# EAGLE design PCB (EAGLE 7.4.0)

## Sheet 1 of 2
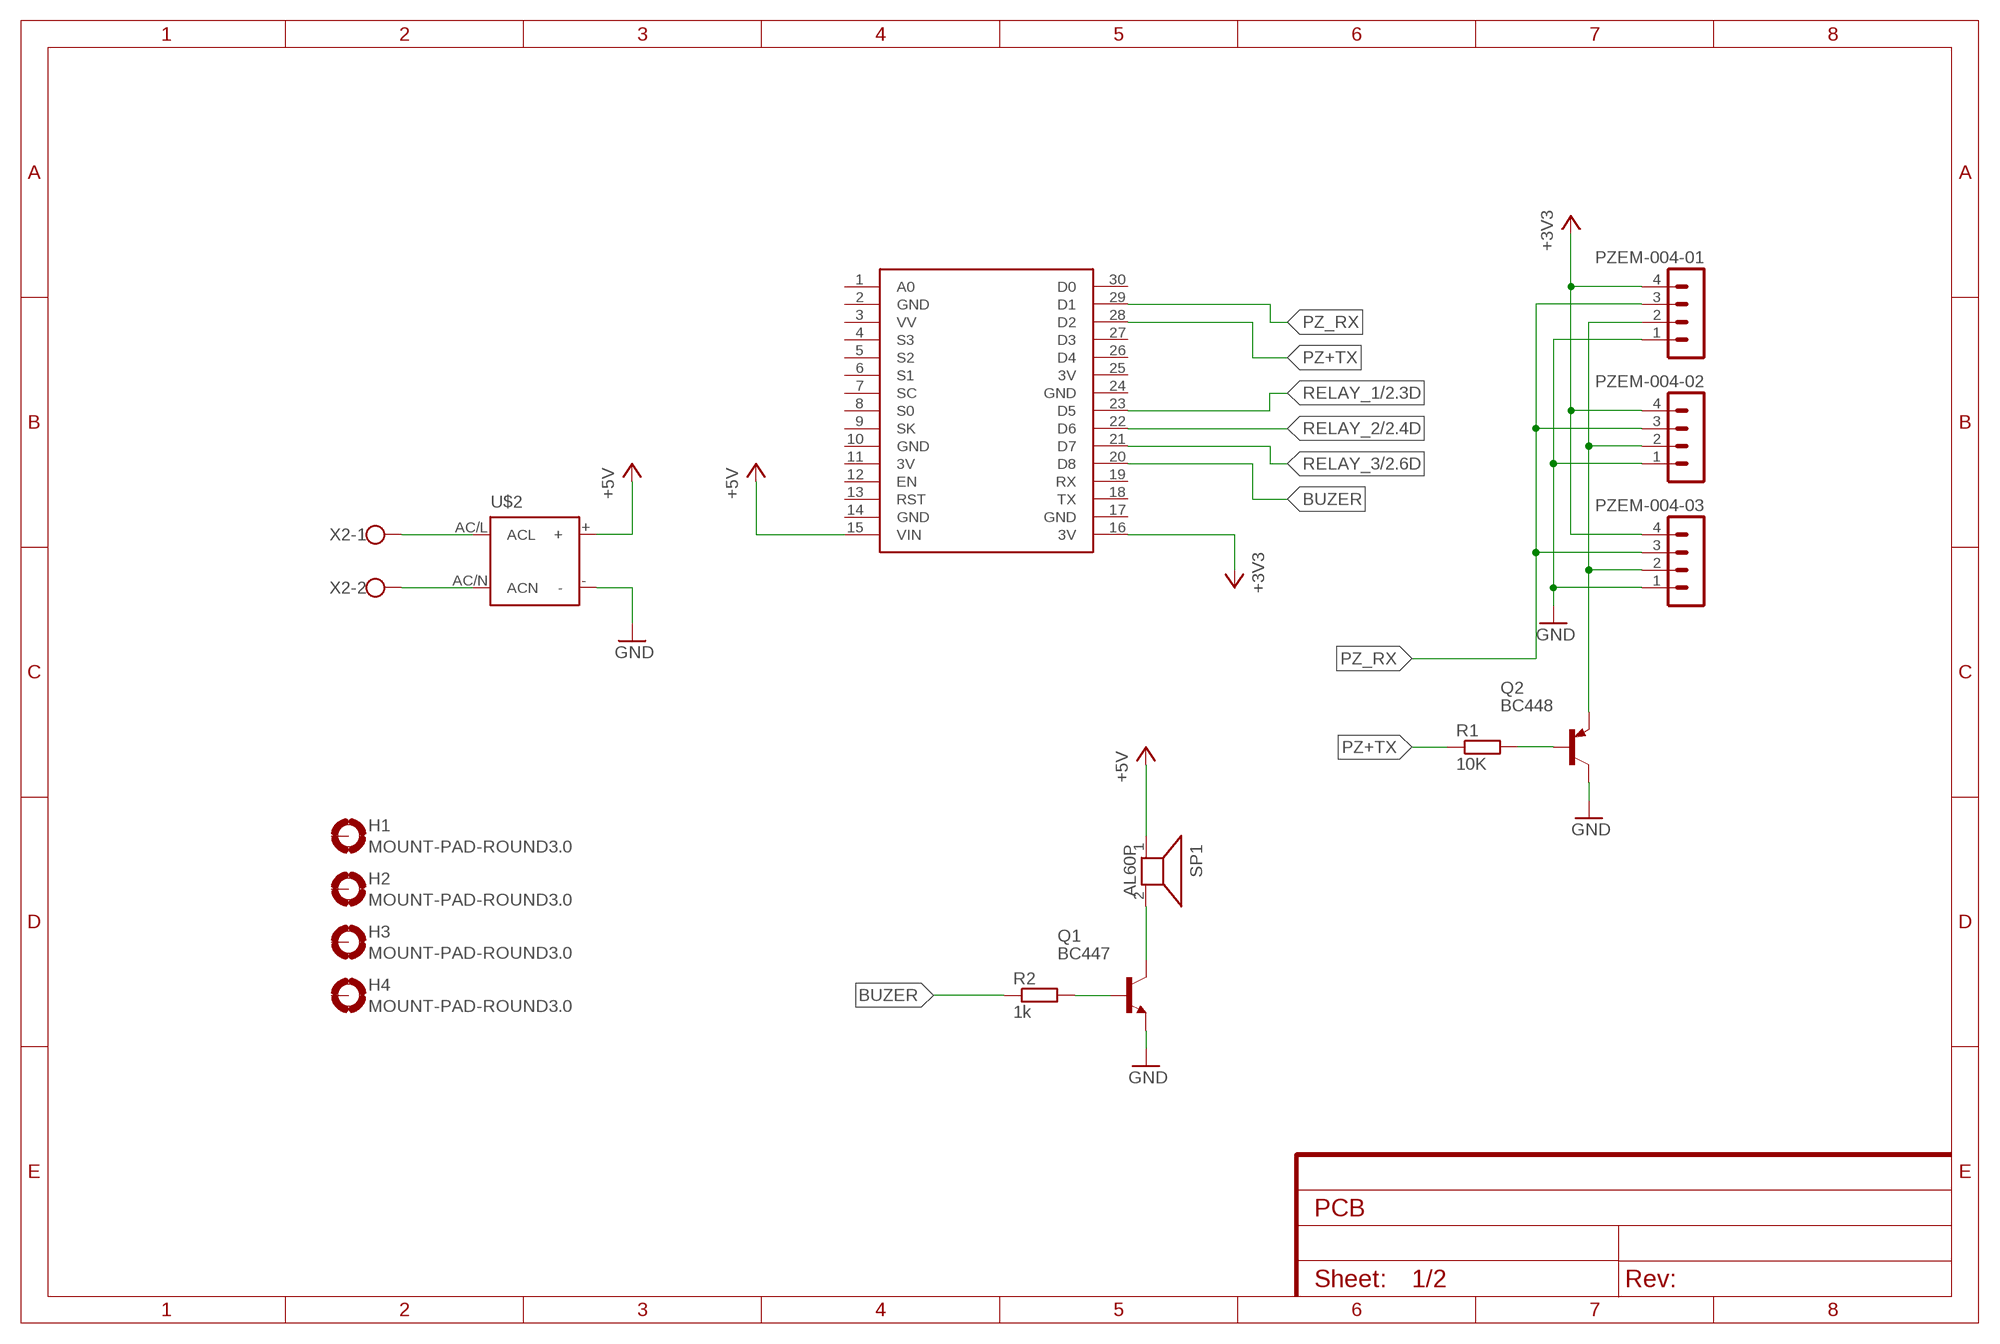
[diagram p0: schematic, sheet 1]

### Parts
H1  MOUNT-PAD-ROUND3.0  [3,0-PAD]
H2  MOUNT-PAD-ROUND3.0  [3,0-PAD]
H3  MOUNT-PAD-ROUND3.0  [3,0-PAD]
H4  MOUNT-PAD-ROUND3.0  [3,0-PAD]
PZEM-004-01  MA04-1  [MA04-1]
PZEM-004-02  MA04-1  [MA04-1]
PZEM-004-03  MA04-1  [MA04-1]
Q1  BC447  [TO92-EBC]
Q2  BC448  [TO92-EBC]
R1  10K  R-EU_0207/10  [0207/10]
R2  1k  R-EU_0207/10  [0207/10]
SP1  AL60P  [AL60P]
U$1  NODEMCU  [NODEMCU]
U$2  PM-05  [PM-05]
X2  W237-102  [W237-102]

### Nets
+3V3: PZEM-004-01.4 PZEM-004-02.4 PZEM-004-03.4 U$1.16(3V)
+5V: SP1.1 U$1.15(VIN) U$2.+ ; also sheet 2
BUZER: R2.1 U$1.20(D8)
GND: PZEM-004-01.1 PZEM-004-02.1 PZEM-004-03.1 Q1.E Q2.C U$2.- ; also sheet 2
N$1: Q1.C SP1.2
N$2: Q1.B R2.2
N$3: Q2.B R1.2
N$4: PZEM-004-01.2 PZEM-004-02.2 PZEM-004-03.2 Q2.E
N$21: U$2.AC/N(ACN) X2.2
N$22: U$2.AC/L(ACL) X2.1
PZ+TX: R1.1 U$1.28(D2)
PZ_RX: PZEM-004-01.3 PZEM-004-02.3 PZEM-004-03.3 U$1.29(D1)
RELAY_1: U$1.23(D5) ; also sheet 2
RELAY_2: U$1.22(D6) ; also sheet 2
RELAY_3: U$1.21(D7) ; also sheet 2
Unconnected: H1.B3,0(MOUNT) H2.B3,0(MOUNT) H3.B3,0(MOUNT) H4.B3,0(MOUNT) U$1.1(A0) U$1.3(VV) U$1.4(S3) U$1.5(S2) U$1.6(S1) U$1.7(SC) U$1.8(S0) U$1.9(SK) U$1.12(EN) U$1.13(RST) U$1.18(TX) U$1.19(RX) U$1.26(D4) U$1.27(D3) U$1.30(D0)

## Sheet 2 of 2
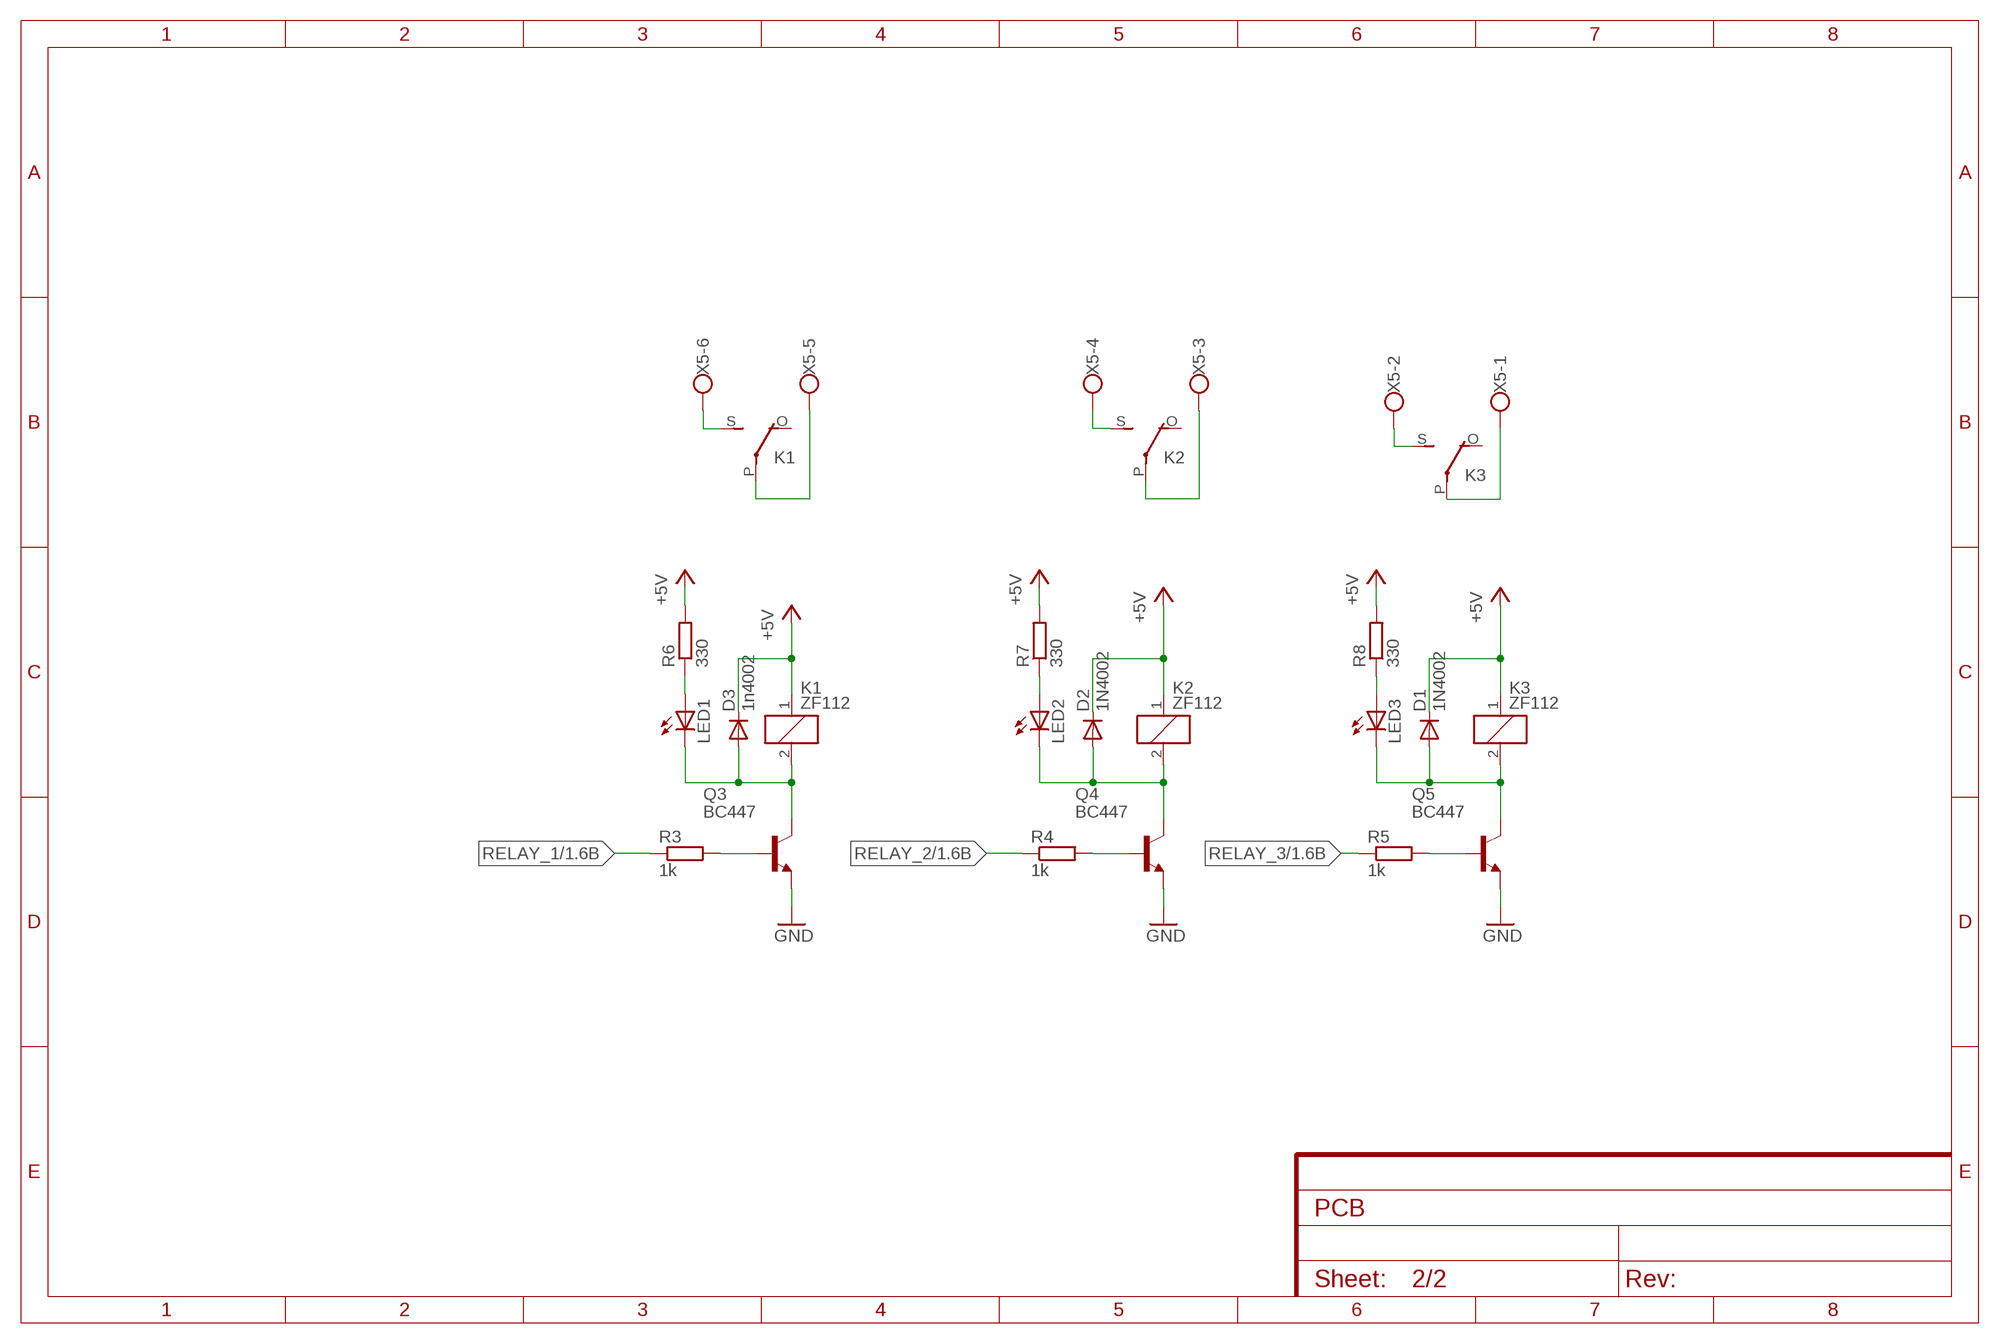
[diagram p1: schematic, sheet 2]

### Parts
D1  1N4002  1N4446  [DO35-10]
D2  1N4002  1N4446  [DO35-10]
D3  1n4002  1N4446  [DO35-10]
K1  ZF112  [ZF112]
K2  ZF112  [ZF112]
K3  ZF112  [ZF112]
LED1  LED5MM  [LED5MM]
LED2  LED5MM  [LED5MM]
LED3  LED5MM  [LED5MM]
Q3  BC447  [TO92-EBC]
Q4  BC447  [TO92-EBC]
Q5  BC447  [TO92-EBC]
R3  1k  R-EU_0207/10  [0207/10]
R4  1k  R-EU_0207/10  [0207/10]
R5  1k  R-EU_0207/10  [0207/10]
R6  330  R-EU_0207/10  [0207/10]
R7  330  R-EU_0207/10  [0207/10]
R8  330  R-EU_0207/10  [0207/10]
X5  W237-6  [W237-6]

### Nets
+5V: D1.C D2.C D3.C K1.1 K2.1 K3.1 R6.2 R7.2 R8.2 ; also sheet 1
GND: Q3.E Q4.E Q5.E ; also sheet 1
N$5: D3.A K1.2 LED1.K(C) Q3.C
N$6: Q3.B R3.2
N$7: D2.A K2.2 LED2.K(C) Q4.C
N$8: Q4.B R4.2
N$9: K3.S(2:S) X5.2
N$10: Q5.B R5.2
N$11: LED1.A R6.1
N$12: K3.P(2:P) X5.1
N$13: LED2.A R7.1
N$14: LED3.A R8.1
N$15: D1.A K3.2 LED3.K(C) Q5.C
N$16: K2.P(2:P) X5.3
N$17: K2.S(2:S) X5.4
N$18: K1.P(2:P) X5.5
N$19: K1.S(2:S) X5.6
RELAY_1: R3.1 ; also sheet 1
RELAY_2: R4.1 ; also sheet 1
RELAY_3: R5.1 ; also sheet 1
Unconnected: K1.O(2:O) K2.O(2:O) K3.O(2:O)

## Power pins joined to a net without a drawn wire
3V: U$1.11(3V) U$1.25(3V)
GND: U$1.2(GND) U$1.10(GND) U$1.14(GND) U$1.17(GND) U$1.24(GND)

## Library data of the parts
D1-D3 = diode:1N4446: DIODE high speed (Philips)
H1-H4 = holes:MOUNT-PAD-ROUND: MOUNTING PAD, round
K1-K3 = relay:ZF112: RELAY 1 x switch; OC_FARNELL: unknown; OC_NEWARK: unknown
LED1-LED3 = led:LED: LED OSRAM: - CHIPLED LG R971, LG N971, LY N971, LG Q971, LY Q971, LO R971, LY R971 LH N974, LH R974 LS Q976, LO Q976, LY Q976 LO Q996 - Hyper CHIPLED LW Q18S LB Q993, LB Q99A, LB R99A - SideLED LS A670, LO A670, LY A670, LG A670, LP A670 LB A673, LV A673, LT A673, LW A673 LH A674 LY A675 LS A676, LA A676, LO A676, LY A676, LW A676 LS A679, LY A679, LG A679 - Hyper Micro SIDELED® LS Y876, LA Y876, LO Y876, LY Y876 LT Y87S - SmartLED LW L88C, LW L88S LB L89C, LB L89S, LG L890 LS L89K, LO L89K, LY L89K LS L896, LA L896, LO L896, LY L896 - TOPLED LS T670, LO T670, LY T670, LG T670, LP T670 LSG T670, LSP T670, LSY T670, LOP T670, LYG T670 LG T671, LOG T671, LSG T671 LB T673, LV T673, LT T673, LW T673 LH T674 LS T676, LA T676, LO T676, LY T676, LB T676, LH T676, LSB T676, LW T676 LB T67C, LV T67C, LT T67C, LS T67K, LO T67K, LY T67K, LW E67C LS E67B, LA E67B, LO E67B, LY E67B, LB E67C, LV E67C, LT E67C LW T67C LS T679, LY T679, LG T679 LS T770, LO T770, LY T770, LG T770, LP T770 LB T773, LV T773, LT T773, LW T773 LH T774 LS E675, LA E675, LY E675, LS T675 LS T776, LA T776, LO T776, LY T776, LB T776 LHGB T686 LT T68C, LB T68C - Hyper Mini TOPLED® LB M676 - Mini TOPLED Santana® LG M470 LS M47K, LO M47K, LY M47K Source: http://www.osram.convergy.de LUXEON: - LUMILED® LXK2-PW12-R00, LXK2-PW12-S00, LXK2-PW14-U00, LXK2-PW14-V00 LXK2-PM12-R00, LXK2-PM12-S00, LXK2-PM14-U00 LXK2-PE12-Q00, LXK2-PE12-R00, LXK2-PE12-S00, LXK2-PE14-T00, LXK2-PE14-U00 LXK2-PB12-K00, LXK2-PB12-L00, LXK2-PB12-M00, LXK2-PB14-N00, LXK2-PB14-P00, LXK2-PB14-Q00 LXK2-PR12-L00, LXK2-PR12-M00, LXK2-PR14-Q00, LXK2-PR14-R00 LXK2-PD12-Q00, LXK2-PD12-R00, LXK2-PD12-S00 LXK2-PH12-R00, LXK2-PH12-S00 LXK2-PL12-P00, LXK2-PL12-Q00, LXK2-PL12-R00 Source: www.luxeon.com KINGBRIGHT: KA-3528ASYC Source: www.kingbright.com
PZEM-004-01-PZEM-004-03 = con-lstb:MA04-1: PIN HEADER; OC_FARNELL: unknown; OC_NEWARK: unknown
Q1 Q3-Q5 = transistor-npn:BC447*: NPN Transistor
Q2 = transistor-pnp:BC448*: PNP Transistror
R1-R8 = rcl:R-EU_: RESISTOR, European symbol
SP1 = buzzer:AL60P: SPEAKER Source: Buerklin; OC_FARNELL: unknown; OC_NEWARK: unknown
U$1 = nodemcu:NODEMCU
U$2 = meanwell_v2:PM-05: On Board Switching Power Supply 5W Output www.meanwell.com
X2 = con-wago-500:W237-102: WAGO SCREW CLAMP; MPN: 237-102; OC_FARNELL: unknown; OC_NEWARK: 70K9898
X5 = con-wago-500:W237-6: WAGO SCREW CLAMP; OC_FARNELL: unknown; OC_NEWARK: unknown

## Board
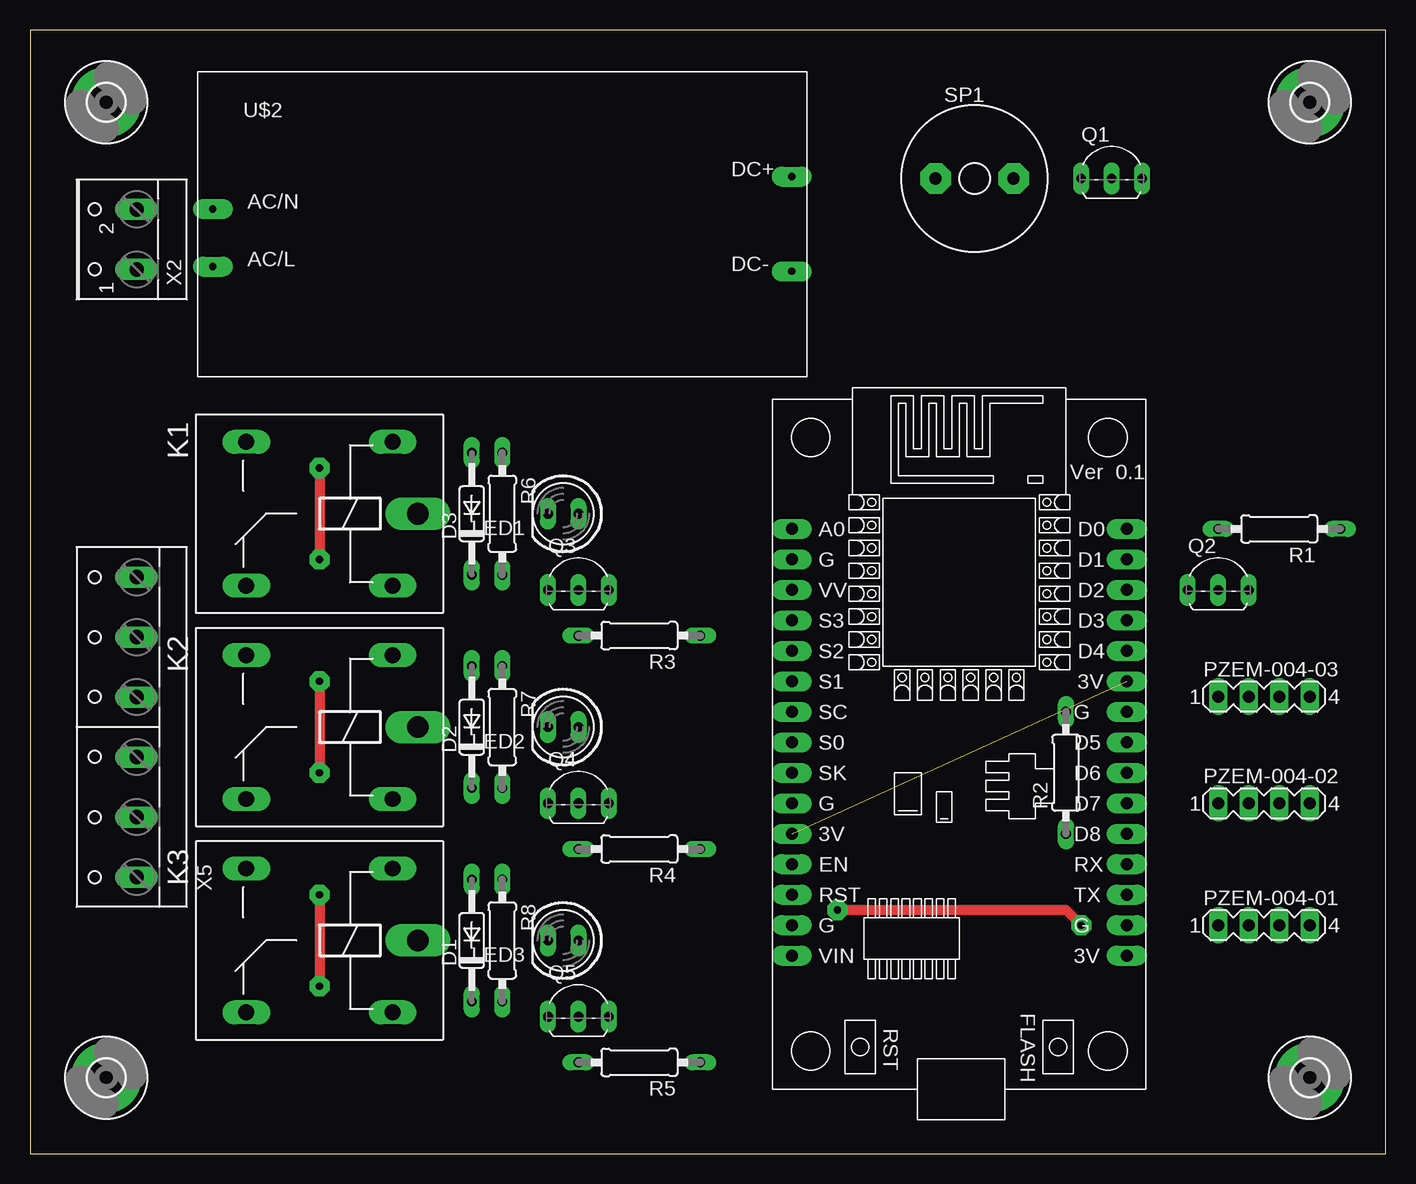
[diagram p2: board, top side]
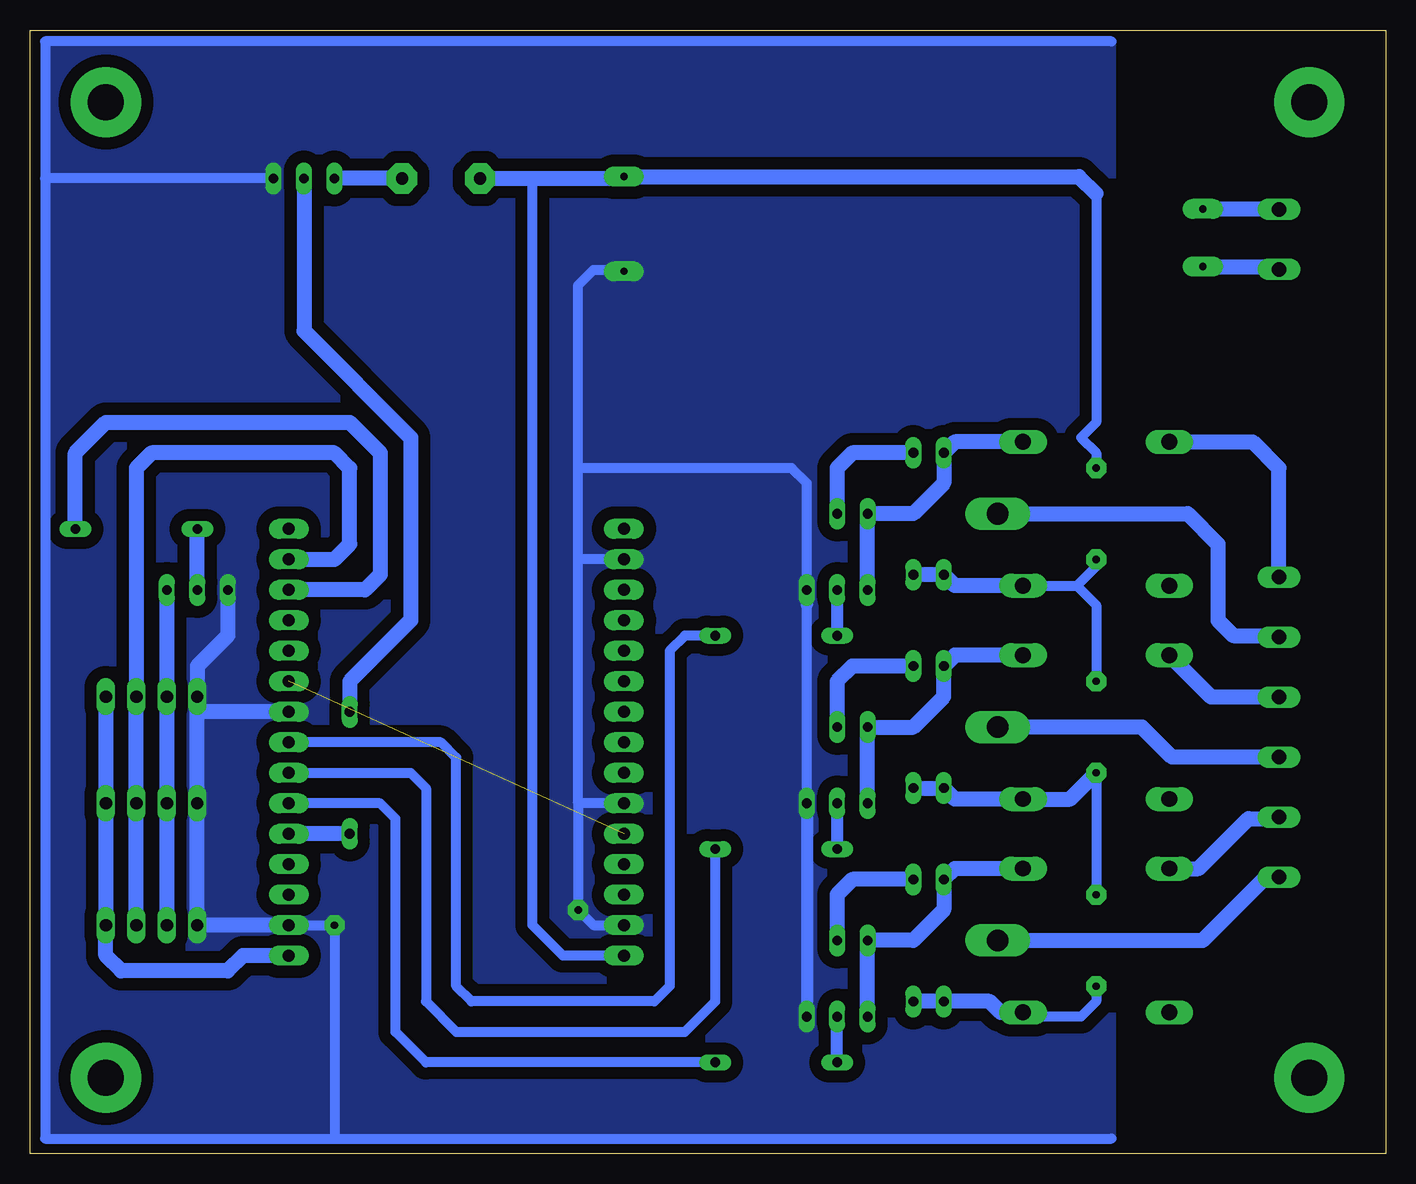
[diagram p3: board, bottom side, seen from below]

Size 113.01 x 93.65 mm. Coordinates in mm from the lower left corner, seen from the top.
Outline: 0,0 113.01,0 113.01,93.65 0,93.65 0,0
Copper layers (1*16): Top 0.035mm / dielectric 1.5mm / Bottom 0.035mm
Design rules "default": minimum track width 10mil, minimum drill 24mil, track to track 8mil, track to pad 8mil, pad to pad 8mil, via to via 8mil, smd to smd 8mil, copper to edge 40mil, drill to drill 8mil, minimum pad ring 10mil, minimum via ring 8mil, stop-mask expansion 4mil, vias tented up to drill 0mil, thermal gap 10mil

### Footprints (pad centres in the part's own frame; a part is rotated, then mirrored left to right if it is on the bottom)
DO35-10 = drill 0.813 long: A 5.08,0; C -5.08,0
3,0-PAD = drill 3 pad 5.842: B3,0 0,0
ZF112 = drill 1.321 long: 1 -6.096,5.994; 2 -6.096,-5.994; O 6.096,5.994; S 6.096,-5.994 | drill 1.803 long: P -8.204,0
LED5MM = drill 0.813 long: A -1.27,0; K 1.27,0
MA04-1 = drill 1.016 long: 1 -3.81,0; 2 -1.27,0; 3 1.27,0; 4 3.81,0
TO92-EBC = drill 0.813 long: B 0,-1.27; C -2.54,-1.27; E 2.54,-1.27
0207/10 = drill 0.813 long: 1 -5.08,0; 2 5.08,0
AL60P = drill 1.016 pad 2.54 octagon: 1 -3.251,0; 2 3.251,0
NODEMCU = drill 1 pad 1.676 long: 1 -13.97,17.78; 2 -13.97,15.24; 3 -13.97,12.7; 4 -13.97,10.16; 5 -13.97,7.62; 6 -13.97,5.08; 7 -13.97,2.54; 8 -13.97,0; 9 -13.97,-2.54; 10 -13.97,-5.08; 11 -13.97,-7.62; 12 -13.97,-10.16; 13 -13.97,-12.7; 14 -13.97,-15.24; 15 -13.97,-17.78; 16 13.97,-17.78; 17 13.97,-15.24; 18 13.97,-12.7; 19 13.97,-10.16; 20 13.97,-7.62; 21 13.97,-5.08; 22 13.97,-2.54; 23 13.97,0; 24 13.97,2.54; 25 13.97,5.08; 26 13.97,7.62; 27 13.97,10.16; 28 13.97,12.7; 29 13.97,15.24; 30 13.97,17.78
PM-05 = drill 0.6 pad 1.676 long: + 21.59,3.97; - 21.59,-3.93; AC/L -26.67,-3.53; AC/N -26.67,1.27
W237-102 = drill 1.194 long: 1 -2.5,-1.27; 2 2.5,-1.27
W237-6 = drill 1.194 long: 1 -12.5,-1.27; 2 -7.5,-1.27; 3 -2.5,-1.27; 4 2.5,-1.27; 5 7.5,-1.27; 6 12.5,-1.27

### Placement (x,y rotation side)
D1  36.83,17.78 90 top
D2  36.83,35.56 90 top
D3  36.83,53.34 90 top
H1  6.35,6.35 0 top
H2  106.68,87.63 0 top
H3  106.68,6.35 0 top
H4  6.35,87.63 0 top
K1  24.13,53.34 180 top
K2  24.13,35.56 180 top
K3  24.13,17.78 180 top
LED1  44.45,53.34 180 top
LED2  44.45,35.56 180 top
LED3  44.45,17.78 180 top
PZEM-004-01  102.87,19.05 0 top
PZEM-004-02  102.87,29.21 0 top
PZEM-004-03  102.87,38.1 0 top
Q1  90.17,82.55 0 top
Q2  99.06,48.26 0 top
Q3  45.72,48.26 0 top
Q4  45.72,30.48 0 top
Q5  45.72,12.7 0 top
R1  104.14,52.07 180 top
R2  86.36,31.75 90 top
R3  50.8,43.18 180 top
R4  50.8,25.4 180 top
R5  50.8,7.62 180 top
R6  39.37,53.34 270 top
R7  39.37,35.56 270 top
R8  39.37,17.78 270 top
SP1  78.74,81.28 0 top
U$1  77.47,34.29 0 top
U$2  41.91,77.47 0 top
X2  7.62,76.2 90 top
X5  7.62,35.56 90 top

### Tracks (layer width: path | path; a pad name or v marks a point on that pad's centre or on a via)
3V  (1 unrouted)
+3V3
  Bottom 1.27: PZEM-004-03.4 PZEM-004-02.4 PZEM-004-01.4 106.68,16.51 105.41,15.24 96.52,15.24 95.25,16.51 U$1.16
+5V  (via drill 0.6 pad 1.68)
  Top 0.813: v24.13,39.37 v24.13,31.75 | v24.13,21.59 v24.13,13.97 | v24.13,57.15 v24.13,49.53
  Bottom 0.813: K1.1 25.76,47.35 | 25.76,47.35 24.13,45.72 v24.13,39.37 | v24.13,31.75 v24.13,21.59 | v24.13,13.97 24.13,12.7 25.4,11.43 29.87,11.43 K3.1 | 24.13,80.01 24.13,60.96 25.4,59.69 24.13,58.42 v24.13,57.15 | v24.13,49.53 24.13,48.97 25.76,47.35 | U$1.15 68.58,16.51 71.12,19.05 71.12,81.28 | 63.66,81.28 U$2.+
  Bottom 1.27: K3.1 32.11,11.79 33.02,12.7 D1.C R8.2 | R7.2 D2.C 35.92,29.57 K2.1 26.31,29.57 v24.13,31.75 | K1.1 35.92,47.35 D3.C R6.2 | U$2.+ 25.56,81.44 24.13,80.01 | 63.66,81.28 71.12,81.28 SP1.1
BUZER
  Bottom 1.27: R2.1 U$1.20
GND  (via drill 0.6 pad 1.68)
  Top 0.813: v67.31,20.32 86.36,20.32 v87.63,19.05
  Bottom 0.813: U$1.10 67.31,29.21 | 67.31,29.21 v67.31,20.32 66.04,19.05 U$1.14 | U$1.2 67.31,49.53 | 67.31,49.53 67.31,57.15 | 67.31,57.15 67.31,72.39 66.04,73.66 63.62,73.66 U$2.- | 67.31,57.15 49.53,57.15 48.26,55.88 Q3.E | 67.31,29.21 67.31,49.53 | Q4.E 48.26,45.72 | Q1.E 111.76,81.28 | 111.76,81.28 111.76,1.27 87.63,1.27 | 87.63,1.27 22.86,1.27 | 22.86,92.71 111.76,92.71 111.76,81.28 | 87.63,1.27 v87.63,19.05 U$1.17
  Bottom 1.016: Q3.E 48.26,45.72 | Q4.E Q5.E
  Bottom 1.27: 99.06,36.83 PZEM-004-02.1 PZEM-004-01.1 U$1.17 | 99.06,36.83 PZEM-004-03.1 99.06,40.64 96.52,43.18 Q2.C | U$1.24 99.06,36.83
  pour Bottom (isolate 1.016, no thermals): 22.86,95.25 114.3,93.98 114.3,-1.27 22.86,-1.27
N$1
  Bottom 1.27: SP1.2 Q1.C
N$2
  Bottom 1.27: Q1.B 90.17,68.58 81.28,59.69 81.28,44.45 86.36,39.37 R2.2
N$3
  Bottom 1.27: Q2.B R1.2
N$4
  Bottom 1.27: PZEM-004-01.2 PZEM-004-02.2 PZEM-004-03.2 Q2.E
N$5
  Bottom 1.27: K1.2 35.92,59.33 D3.A 36.83,55.88 39.37,53.34 LED1.K Q3.C
N$6
  Bottom 1.016: Q3.B R3.2
N$7
  Bottom 1.27: K2.2 35.92,41.55 D2.A 36.83,38.1 39.37,35.56 LED2.K Q4.C
N$8
  Bottom 1.016: Q4.B R4.2
N$9
  Bottom 1.27: K3.S 15.6,23.77 11.43,27.94 9.01,27.94 X5.2
N$10
  Bottom 1.016: R5.2 Q5.B
N$11
  Bottom 1.27: R6.1 44.45,58.42 45.72,57.15 LED1.A
N$12
  Bottom 1.27: K3.P 15.24,17.78 10.16,22.86 9.09,22.86 X5.1
N$13
  Bottom 1.27: R7.1 44.45,40.64 45.72,39.37 LED2.A
N$14
  Bottom 1.27: R8.1 44.45,22.86 45.72,21.59 LED3.A
N$15
  Bottom 1.27: K3.2 35.92,23.77 D1.A 36.83,20.32 39.37,17.78 LED3.K Q5.C
N$16
  Bottom 1.27: X5.3 17.82,33.06 20.32,35.56 K2.P
N$17
  Bottom 1.27: X5.4 14.54,38.06 K2.S
N$18
  Bottom 1.27: K1.P 16.51,53.34 13.97,50.8 13.97,44.45 12.7,43.18 9.01,43.18 X5.5
N$19
  Bottom 1.27: X5.6 8.89,57.15 11.07,59.33 K1.S
N$21
  Bottom 1.27: X2.2 15.2,78.7 U$2.AC/N
N$22
  Bottom 1.27: U$2.AC/L 9.13,73.94 X2.1
PZ+TX
  Bottom 1.27: R1.1 109.22,58.42 106.68,60.96 86.36,60.96 83.82,58.42 83.82,48.26 85.09,46.99 U$1.28
PZ_RX
  Bottom 1.27: PZEM-004-01.3 PZEM-004-02.3 PZEM-004-03.3 104.14,57.15 102.87,58.42 87.63,58.42 86.36,57.15 86.36,50.8 87.63,49.53 U$1.29
RELAY_1
  Bottom 0.813: R3.1 58.42,43.18 59.69,41.91 59.69,13.97 60.96,12.7 76.2,12.7 77.47,13.97 77.47,33.02 78.74,34.29 U$1.23
RELAY_2
  Bottom 0.813: U$1.22 81.28,31.75 80.01,30.48 80.01,12.7 77.47,10.16 58.42,10.16 55.88,12.7 R4.1
RELAY_3
  Bottom 0.813: R5.1 80.01,7.62 82.55,10.16 82.55,27.94 83.82,29.21 U$1.21